# EAGLE design AD_inputs (EAGLE 7.7.0)
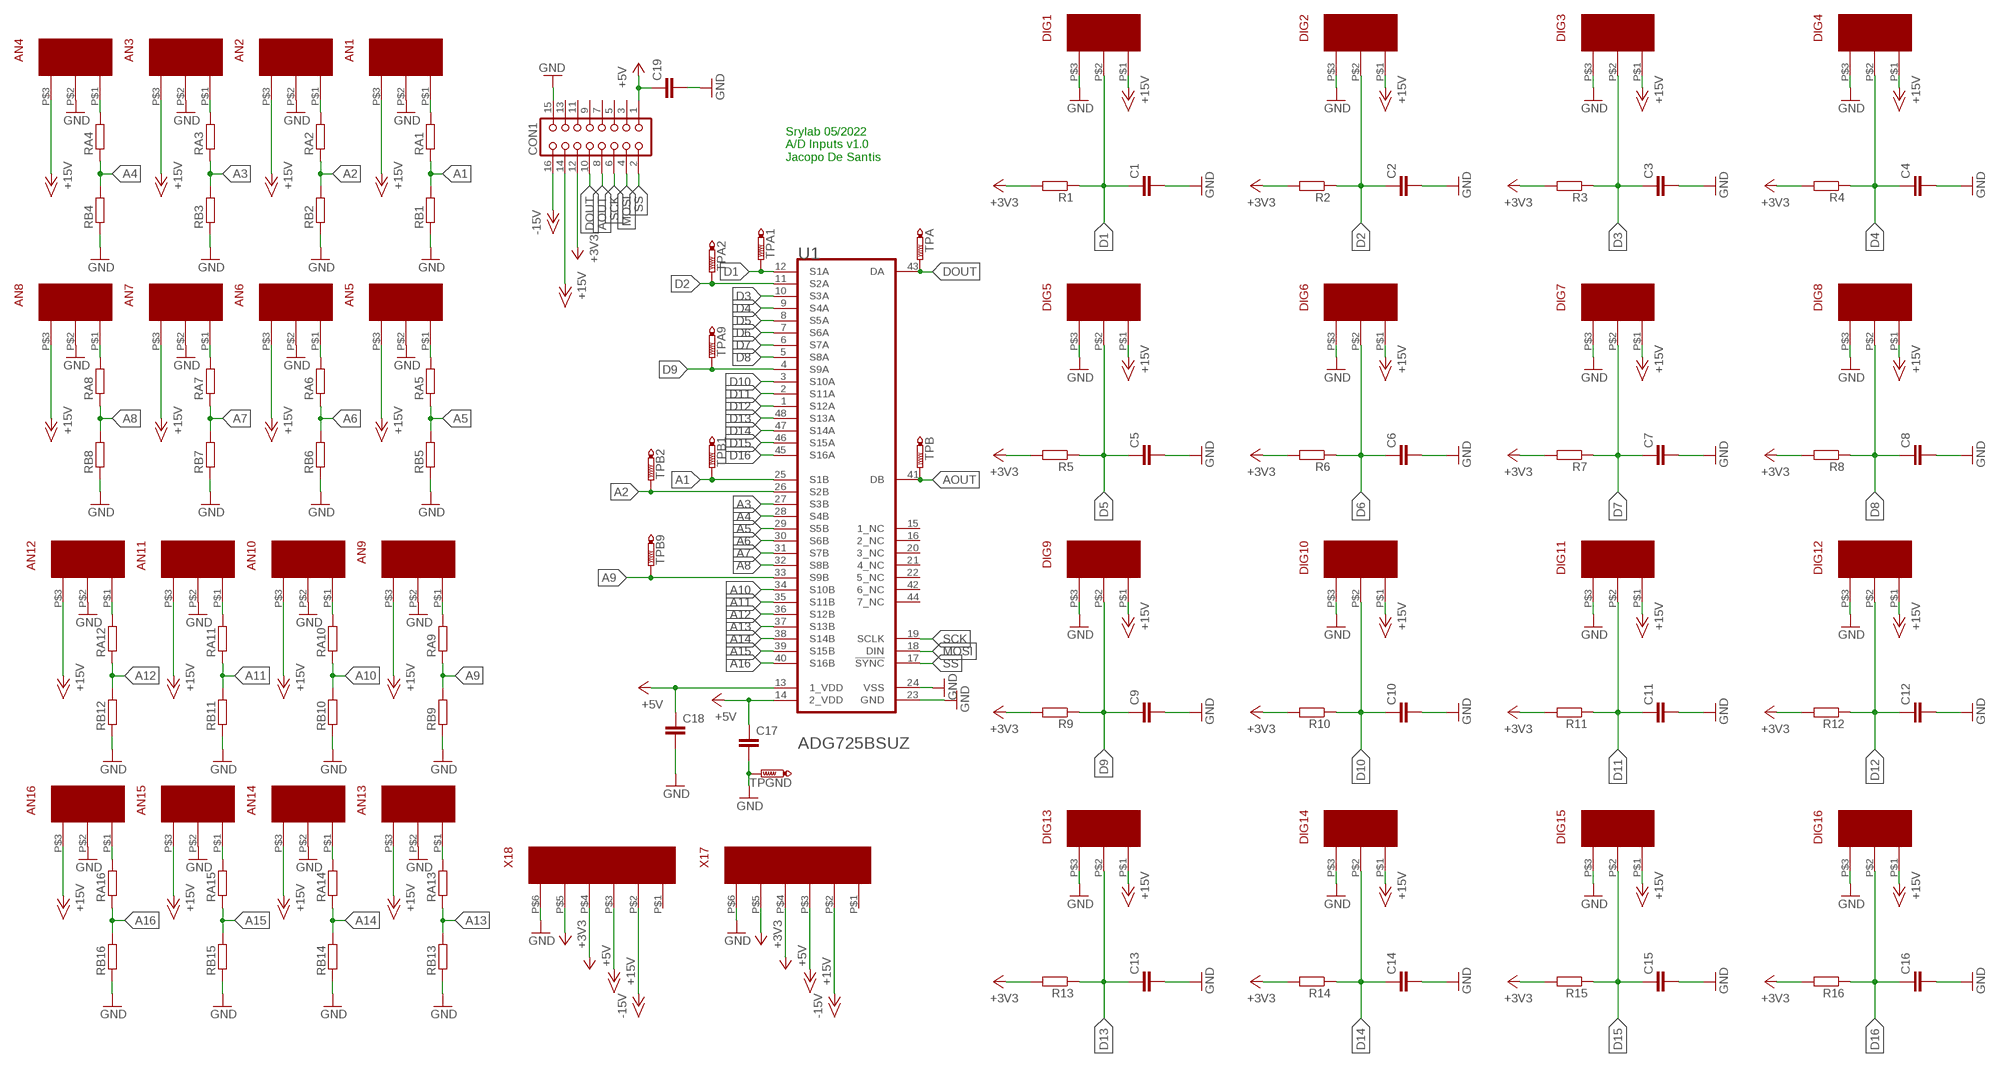
[diagram p0: schematic, sheet 1]

## Parts
AN1  3PIN_CON  [3PIN_CON]
AN2  3PIN_CON  [3PIN_CON]
AN3  3PIN_CON  [3PIN_CON]
AN4  3PIN_CON  [3PIN_CON]
AN5  3PIN_CON  [3PIN_CON]
AN6  3PIN_CON  [3PIN_CON]
AN7  3PIN_CON  [3PIN_CON]
AN8  3PIN_CON  [3PIN_CON]
AN9  3PIN_CON  [3PIN_CON]
AN10  3PIN_CON  [3PIN_CON]
AN11  3PIN_CON  [3PIN_CON]
AN12  3PIN_CON  [3PIN_CON]
AN13  3PIN_CON  [3PIN_CON]
AN14  3PIN_CON  [3PIN_CON]
AN15  3PIN_CON  [3PIN_CON]
AN16  3PIN_CON  [3PIN_CON]
C1  C-EU_SMD0805  [C0805]
C2  C-EU_SMD0805  [C0805]
C3  C-EU_SMD0805  [C0805]
C4  C-EU_SMD0805  [C0805]
C5  C-EU_SMD0805  [C0805]
C6  C-EU_SMD0805  [C0805]
C7  C-EU_SMD0805  [C0805]
C8  C-EU_SMD0805  [C0805]
C9  C-EU_SMD0805  [C0805]
C10  C-EU_SMD0805  [C0805]
C11  C-EU_SMD0805  [C0805]
C12  C-EU_SMD0805  [C0805]
C13  C-EU_SMD0805  [C0805]
C14  C-EU_SMD0805  [C0805]
C15  C-EU_SMD0805  [C0805]
C16  C-EU_SMD0805  [C0805]
C17  C-EU_SMDC1206H/D  [C1206H/D]
C18  C-EU_SMDC1206H/D  [C1206H/D]
C19  C-EU_SMDC1206H/D  [C1206H/D]
CON1  CON16L  [CON16L]
DIG1  3PIN_CON  [3PIN_CON]
DIG2  3PIN_CON  [3PIN_CON]
DIG3  3PIN_CON  [3PIN_CON]
DIG4  3PIN_CON  [3PIN_CON]
DIG5  3PIN_CON  [3PIN_CON]
DIG6  3PIN_CON  [3PIN_CON]
DIG7  3PIN_CON  [3PIN_CON]
DIG8  3PIN_CON  [3PIN_CON]
DIG9  3PIN_CON  [3PIN_CON]
DIG10  3PIN_CON  [3PIN_CON]
DIG11  3PIN_CON  [3PIN_CON]
DIG12  3PIN_CON  [3PIN_CON]
DIG13  3PIN_CON  [3PIN_CON]
DIG14  3PIN_CON  [3PIN_CON]
DIG15  3PIN_CON  [3PIN_CON]
DIG16  3PIN_CON  [3PIN_CON]
R1  R-EU_SMD0805H  [R0805H]
R2  R-EU_SMD0805H  [R0805H]
R3  R-EU_SMD0805H  [R0805H]
R4  R-EU_SMD0805H  [R0805H]
R5  R-EU_SMD0805H  [R0805H]
R6  R-EU_SMD0805H  [R0805H]
R7  R-EU_SMD0805H  [R0805H]
R8  R-EU_SMD0805H  [R0805H]
R9  R-EU_SMD0805H  [R0805H]
R10  R-EU_SMD0805H  [R0805H]
R11  R-EU_SMD0805H  [R0805H]
R12  R-EU_SMD0805H  [R0805H]
R13  R-EU_SMD0805H  [R0805H]
R14  R-EU_SMD0805H  [R0805H]
R15  R-EU_SMD0805H  [R0805H]
R16  R-EU_SMD0805H  [R0805H]
RA1  R-EU_SMD0805H  [R0805H]
RA2  R-EU_SMD0805H  [R0805H]
RA3  R-EU_SMD0805H  [R0805H]
RA4  R-EU_SMD0805H  [R0805H]
RA5  R-EU_SMD0805H  [R0805H]
RA6  R-EU_SMD0805H  [R0805H]
RA7  R-EU_SMD0805H  [R0805H]
RA8  R-EU_SMD0805H  [R0805H]
RA9  R-EU_SMD0805H  [R0805H]
RA10  R-EU_SMD0805H  [R0805H]
RA11  R-EU_SMD0805H  [R0805H]
RA12  R-EU_SMD0805H  [R0805H]
RA13  R-EU_SMD0805H  [R0805H]
RA14  R-EU_SMD0805H  [R0805H]
RA15  R-EU_SMD0805H  [R0805H]
RA16  R-EU_SMD0805H  [R0805H]
RB1  R-EU_SMD0805H  [R0805H]
RB2  R-EU_SMD0805H  [R0805H]
RB3  R-EU_SMD0805H  [R0805H]
RB4  R-EU_SMD0805H  [R0805H]
RB5  R-EU_SMD0805H  [R0805H]
RB6  R-EU_SMD0805H  [R0805H]
RB7  R-EU_SMD0805H  [R0805H]
RB8  R-EU_SMD0805H  [R0805H]
RB9  R-EU_SMD0805H  [R0805H]
RB10  R-EU_SMD0805H  [R0805H]
RB11  R-EU_SMD0805H  [R0805H]
RB12  R-EU_SMD0805H  [R0805H]
RB13  R-EU_SMD0805H  [R0805H]
RB14  R-EU_SMD0805H  [R0805H]
RB15  R-EU_SMD0805H  [R0805H]
RB16  R-EU_SMD0805H  [R0805H]
TPA  PTR1TP20R  [TP20R]
TPA1  PTR1TP20R  [TP20R]
TPA2  PTR1TP20R  [TP20R]
TPA9  PTR1TP20R  [TP20R]
TPB  PTR1TP20R  [TP20R]
TPB1  PTR1TP20R  [TP20R]
TPB2  PTR1TP20R  [TP20R]
TPB9  PTR1TP20R  [TP20R]
TPGND  PTR1TP20R  [TP20R]
U1  ANALOG_DEVICES_ADG725BSUZANALOG_DEVICES_ADG725BSUZ_0_2  [ANALOG_DEVICES_ADG725BSUZ_2]
X17  6PIN_CON  [6PIN_CON]
X18  6PIN_CON  [6PIN_CON]

## Nets
+3V3: CON1.12 R1.2 R2.2 R3.2 R4.2 R5.2 R6.2 R7.2 R8.2 R9.2 R10.2 R11.2 R12.2 R13.2 R14.2 R15.2 R16.2 X17.P$5 X18.P$5
+5V: C17.1 C18.1 C19.1 CON1.1 U1.13(1_VDD) U1.14(2_VDD) X17.P$4 X18.P$4
+15V: AN1.P$3 AN2.P$3 AN3.P$3 AN4.P$3 AN5.P$3 AN6.P$3 AN7.P$3 AN8.P$3 AN9.P$3 AN10.P$3 AN11.P$3 AN12.P$3 AN13.P$3 AN14.P$3 AN15.P$3 AN16.P$3 CON1.14 DIG1.P$1 DIG2.P$1 DIG3.P$1 DIG4.P$1 DIG5.P$1 DIG6.P$1 DIG7.P$1 DIG8.P$1 DIG9.P$1 DIG10.P$1 DIG11.P$1 DIG12.P$1 DIG13.P$1 DIG14.P$1 DIG15.P$1 DIG16.P$1 X17.P$3 X18.P$3
-15V: CON1.16 X17.P$2 X18.P$2
A1: RA1.1 RB1.2 TPB1.TP U1.25(S1B)
A2: RA2.1 RB2.2 TPB2.TP U1.26(S2B)
A3: RA3.1 RB3.2 U1.27(S3B)
A4: RA4.1 RB4.2 U1.28(S4B)
A5: RA5.1 RB5.2 U1.29(S5B)
A6: RA6.1 RB6.2 U1.30(S6B)
A7: RA7.1 RB7.2 U1.31(S7B)
A8: RA8.1 RB8.2 U1.32(S8B)
A9: RA9.1 RB9.2 TPB9.TP U1.33(S9B)
A10: RA10.1 RB10.2 U1.34(S10B)
A11: RA11.1 RB11.2 U1.35(S11B)
A12: RA12.1 RB12.2 U1.36(S12B)
A13: RA13.1 RB13.2 U1.37(S13B)
A14: RA14.1 RB14.2 U1.38(S14B)
A15: RA15.1 RB15.2 U1.39(S15B)
A16: RA16.1 RB16.2 U1.40(S16B)
AOUT: CON1.8 TPB.TP U1.41(DB)
D1: C1.1 DIG1.P$2 R1.1 TPA1.TP U1.12(S1A)
D2: C2.1 DIG2.P$2 R2.1 TPA2.TP U1.11(S2A)
D3: C3.1 DIG3.P$2 R3.1 U1.10(S3A)
D4: C4.1 DIG4.P$2 R4.1 U1.9(S4A)
D5: C5.1 DIG5.P$2 R5.1 U1.8(S5A)
D6: C6.1 DIG6.P$2 R6.1 U1.7(S6A)
D7: C7.1 DIG7.P$2 R7.1 U1.6(S7A)
D8: C8.1 DIG8.P$2 R8.1 U1.5(S8A)
D9: C9.1 DIG9.P$2 R9.1 TPA9.TP U1.4(S9A)
D10: C10.1 DIG10.P$2 R10.1 U1.3(S10A)
D11: C11.1 DIG11.P$2 R11.1 U1.2(S11A)
D12: C12.1 DIG12.P$2 R12.1 U1.1(S12A)
D13: C13.1 DIG13.P$2 R13.1 U1.48(S13A)
D14: C14.1 DIG14.P$2 R14.1 U1.47(S14A)
D15: C15.1 DIG15.P$2 R15.1 U1.46(S15A)
D16: C16.1 DIG16.P$2 R16.1 U1.45(S16A)
DOUT: CON1.10 TPA.TP U1.43(DA)
GND: AN1.P$2 AN2.P$2 AN3.P$2 AN4.P$2 AN5.P$2 AN6.P$2 AN7.P$2 AN8.P$2 AN9.P$2 AN10.P$2 AN11.P$2 AN12.P$2 AN13.P$2 AN14.P$2 AN15.P$2 AN16.P$2 C1.2 C2.2 C3.2 C4.2 C5.2 C6.2 C7.2 C8.2 C9.2 C10.2 C11.2 C12.2 C13.2 C14.2 C15.2 C16.2 C17.2 C18.2 C19.2 CON1.15 DIG1.P$3 DIG2.P$3 DIG3.P$3 DIG4.P$3 DIG5.P$3 DIG6.P$3 DIG7.P$3 DIG8.P$3 DIG9.P$3 DIG10.P$3 DIG11.P$3 DIG12.P$3 DIG13.P$3 DIG14.P$3 DIG15.P$3 DIG16.P$3 RB1.1 RB2.1 RB3.1 RB4.1 RB5.1 RB6.1 RB7.1 RB8.1 RB9.1 RB10.1 RB11.1 RB12.1 RB13.1 RB14.1 RB15.1 RB16.1 TPGND.TP U1.23(GND) U1.24(VSS) X17.P$6 X18.P$6
MOSI: CON1.4 U1.18(DIN)
N$1: AN2.P$1 RA2.2
N$2: AN1.P$1 RA1.2
N$3: AN3.P$1 RA3.2
N$4: AN4.P$1 RA4.2
N$5: AN5.P$1 RA5.2
N$6: AN6.P$1 RA6.2
N$7: AN7.P$1 RA7.2
N$8: AN8.P$1 RA8.2
N$9: AN9.P$1 RA9.2
N$10: AN10.P$1 RA10.2
N$11: AN11.P$1 RA11.2
N$12: AN12.P$1 RA12.2
N$13: AN13.P$1 RA13.2
N$14: AN14.P$1 RA14.2
N$15: AN15.P$1 RA15.2
N$16: AN16.P$1 RA16.2
SCK: CON1.6 U1.19(SCLK)
SS: CON1.2 U1.17(!SYNC!)
Unconnected: CON1.3 CON1.5 CON1.7 CON1.9 CON1.11 CON1.13 U1.15(1_NC) U1.16(2_NC) U1.20(3_NC) U1.21(4_NC) U1.22(5_NC) U1.42(6_NC) U1.44(7_NC) X17.P$1 X18.P$1

## Notes on the sheet
- Srylab 05/2022
  A/D Inputs v1.0
  Jacopo De Santis

## Library data of the parts
AN1-AN16 DIG1-DIG16 = CoilCircuitLibrary_E7:3PIN_CON
C1-C19 = 1AKarstenLib:C-EU_SMD: Capacitor, SMD only European Symbol Copied/Created July 2012 by K.F. Changed September 2016 by K.F.
CON1 = con-harting:CON16L: CONNECTOR; OC_FARNELL: unknown; OC_NEWARK: unknown
R1-R16 RA1-RA16 RB1-RB16 = 1AKarstenLib:R-EU_SMD: Resistor, SMD only European Symbol Copied/Created July 2012 by K.F.
TPA TPA1 TPA2 TPA9 TPB TPB1 TPB2 TPB9 TPGND = testpad:PTR1: TEST PIN
U1 = Analog Devices - ADG725BSUZ:ANALOG_DEVICES_ADG725BSUZ: ADI-ADG725-SU-48; BANDWIDTH_HZ: 34M; CIIVA_IDS: 987218; CODE__JEDEC: MS-026ABC; COMPONENT_LINK_1_DESCRIPTION: Manufacturer URL; COMPONENT_LINK_1_URL: http://www.analog.com/en/index.html; COMPONENT_LINK_3_DESCRIPTION: Package Specification; COMPONENT_LINK_3_URL: http://www.analog.com/static/imported-files/packages/470644706845302410119987SU48_7x7.pdf; DATASHEET: http://www.analog.com/static/imported-files/data_sheets/ADG725_731.pdf; DATASHEET_VERSION: Rev. A; FOOTPRINT_VARIANT_NAME_0: Level C; FOOTPRINT_VARIANT_NAME_1: Level B; FOOTPRINT_VARIANT_NAME_2: Level A; IMPORTED: yes; IMPORTED_FROM: vault; IMPORT_TS: 1521844804; MAX_ANALOG_SIGNAL_RANGE: Vss to Vdd; MF: Analog Devices; MOUNTING_TECHNOLOGY: Surface Mount; MPN: ADG725BSUZ; PACKAGE: SU-48; PACKAGE_DESCRIPTION: 48-Pin Thin Plastic Quad Flat Package, Body 7 x 7 mm, Pitch 0.5 mm; PACKING: Tray; PIN_0_0_18_INSIDE_EDGE: clock; PREFIX: U; RELEASE_DATE: 1391107388; RON_OHMS: 4; SUPPLY_V_GUAR_PERFORMANCE: Dual_(+/-2.5V), Single_(+3V), Single_(+5V); T_TRANSITION_S: 42n; VAULT_GUID: 7876A2FD-0DAB-484C-9F25-628C39C8E5EF; VAULT_REVISION: 63445D66-2062-4CF5-BB4E-A8A3DC790AA5
X17 X18 = CoilCircuitLibrary_E7:6PIN_CON

## Board
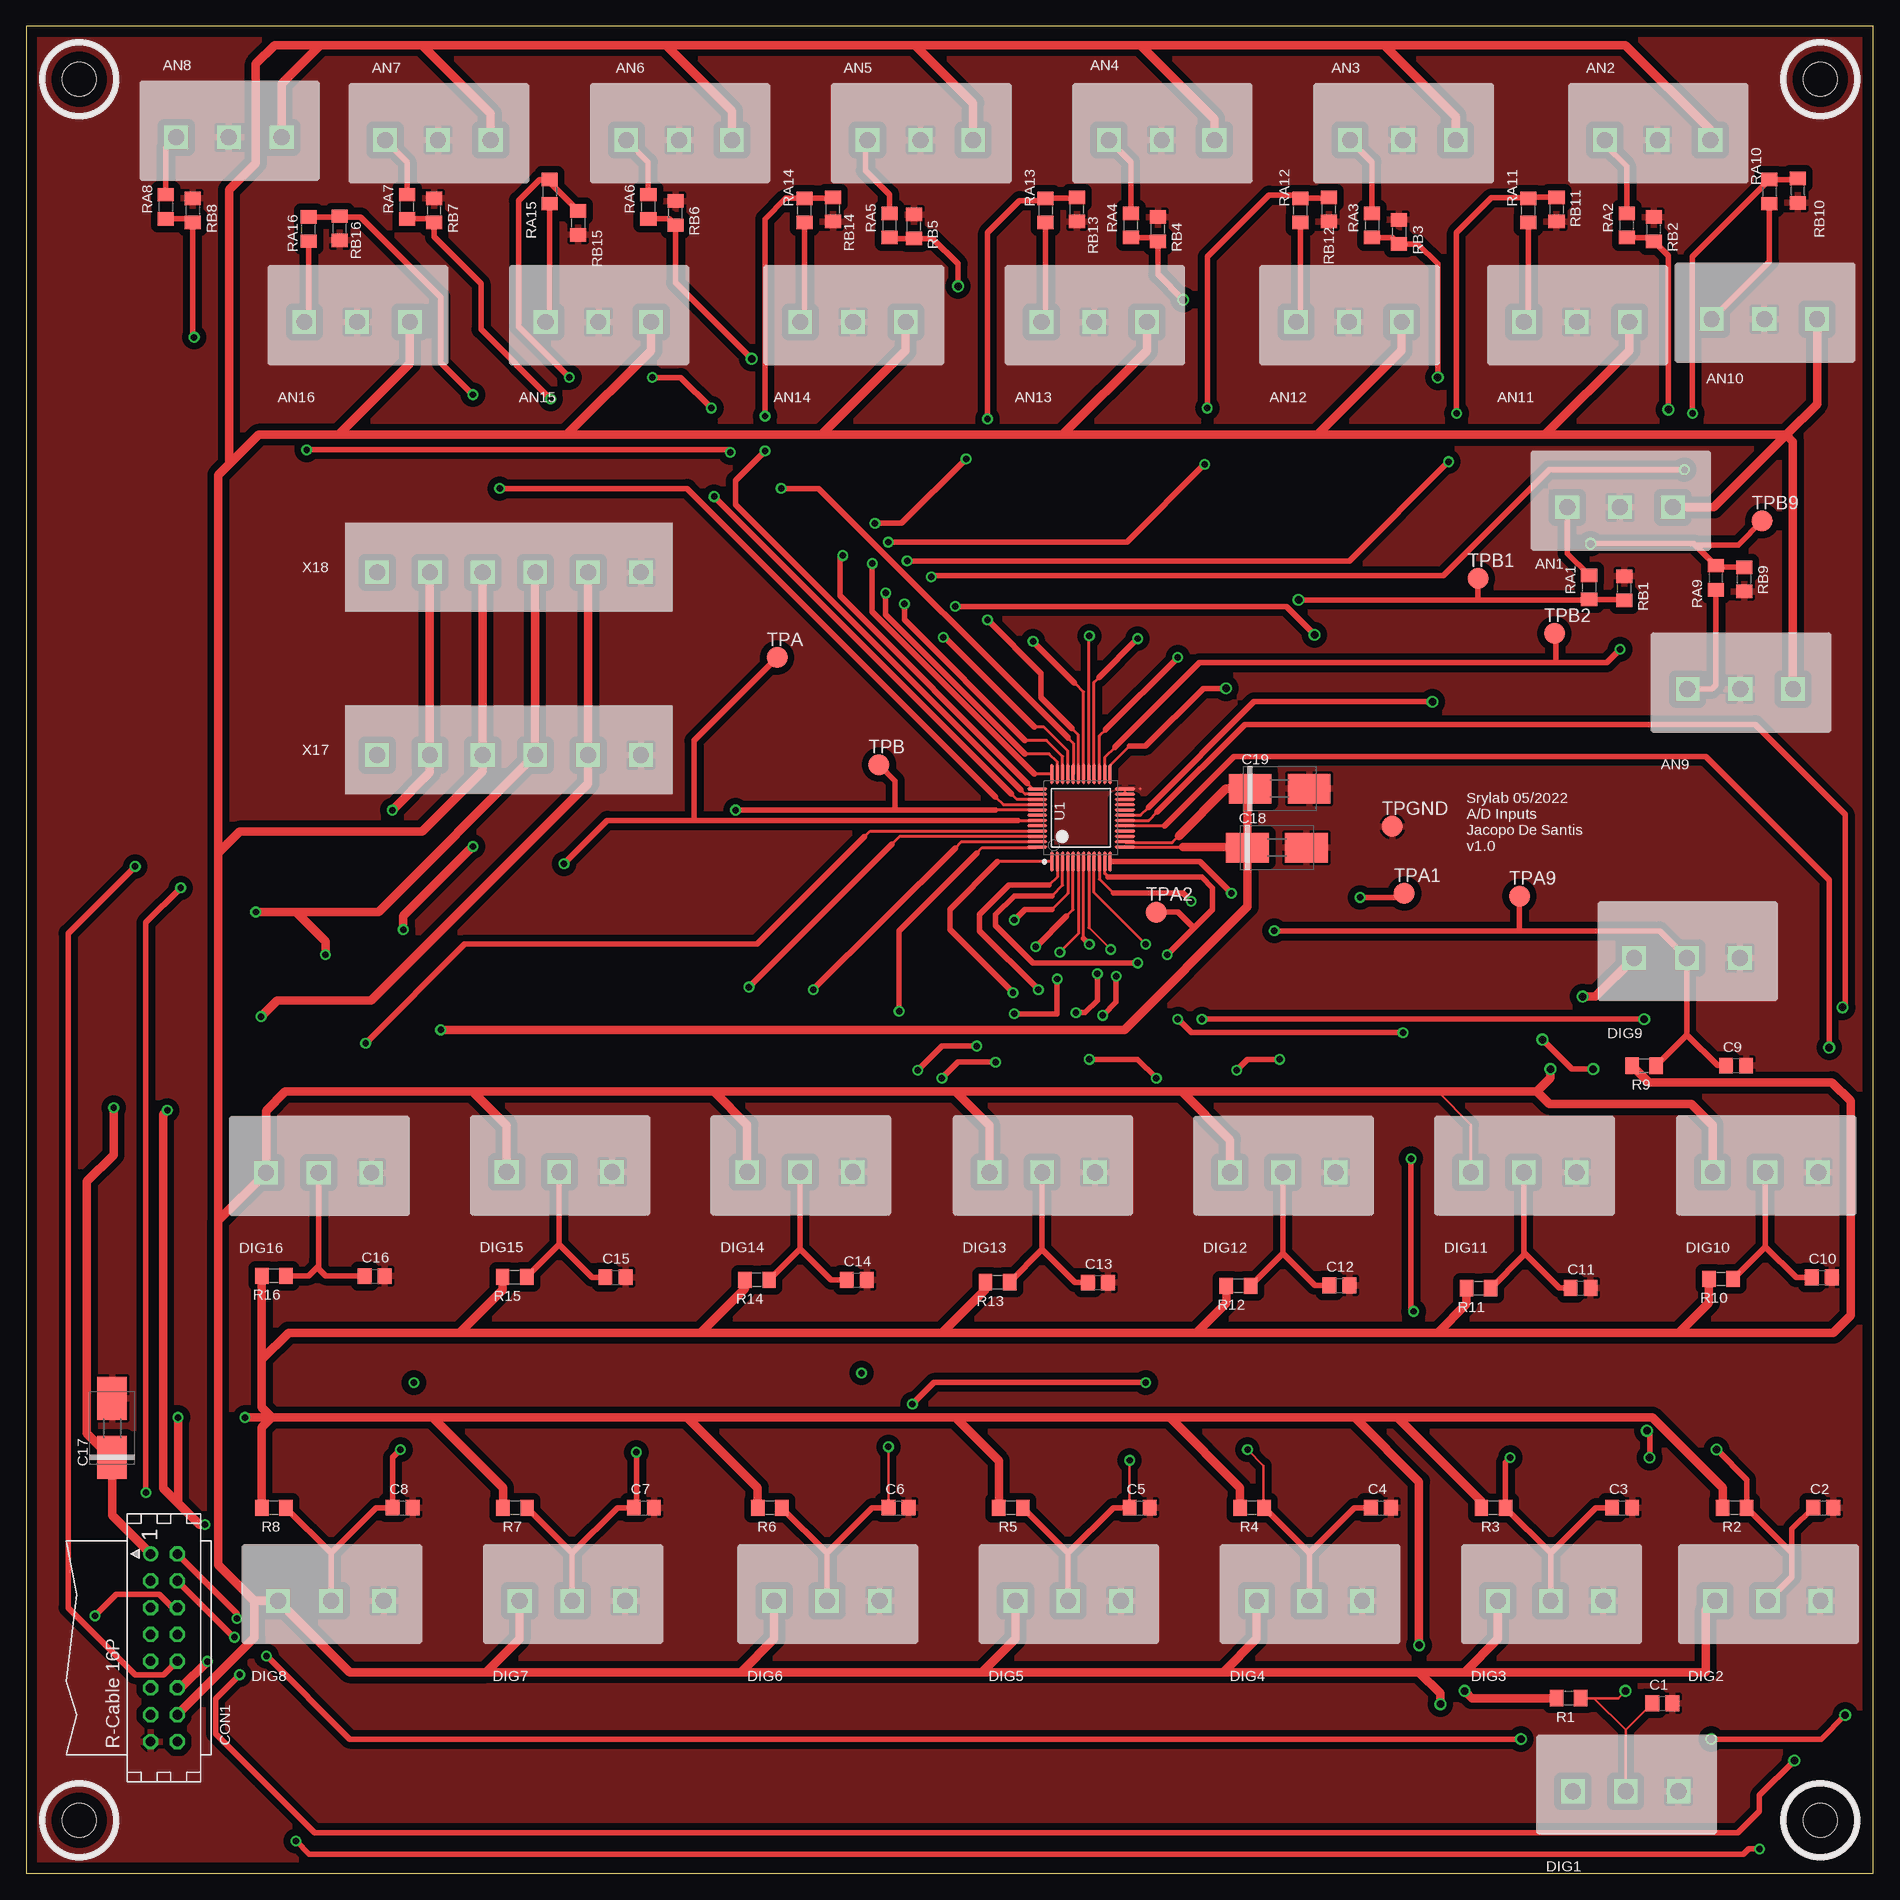
[diagram p1: board, top side]
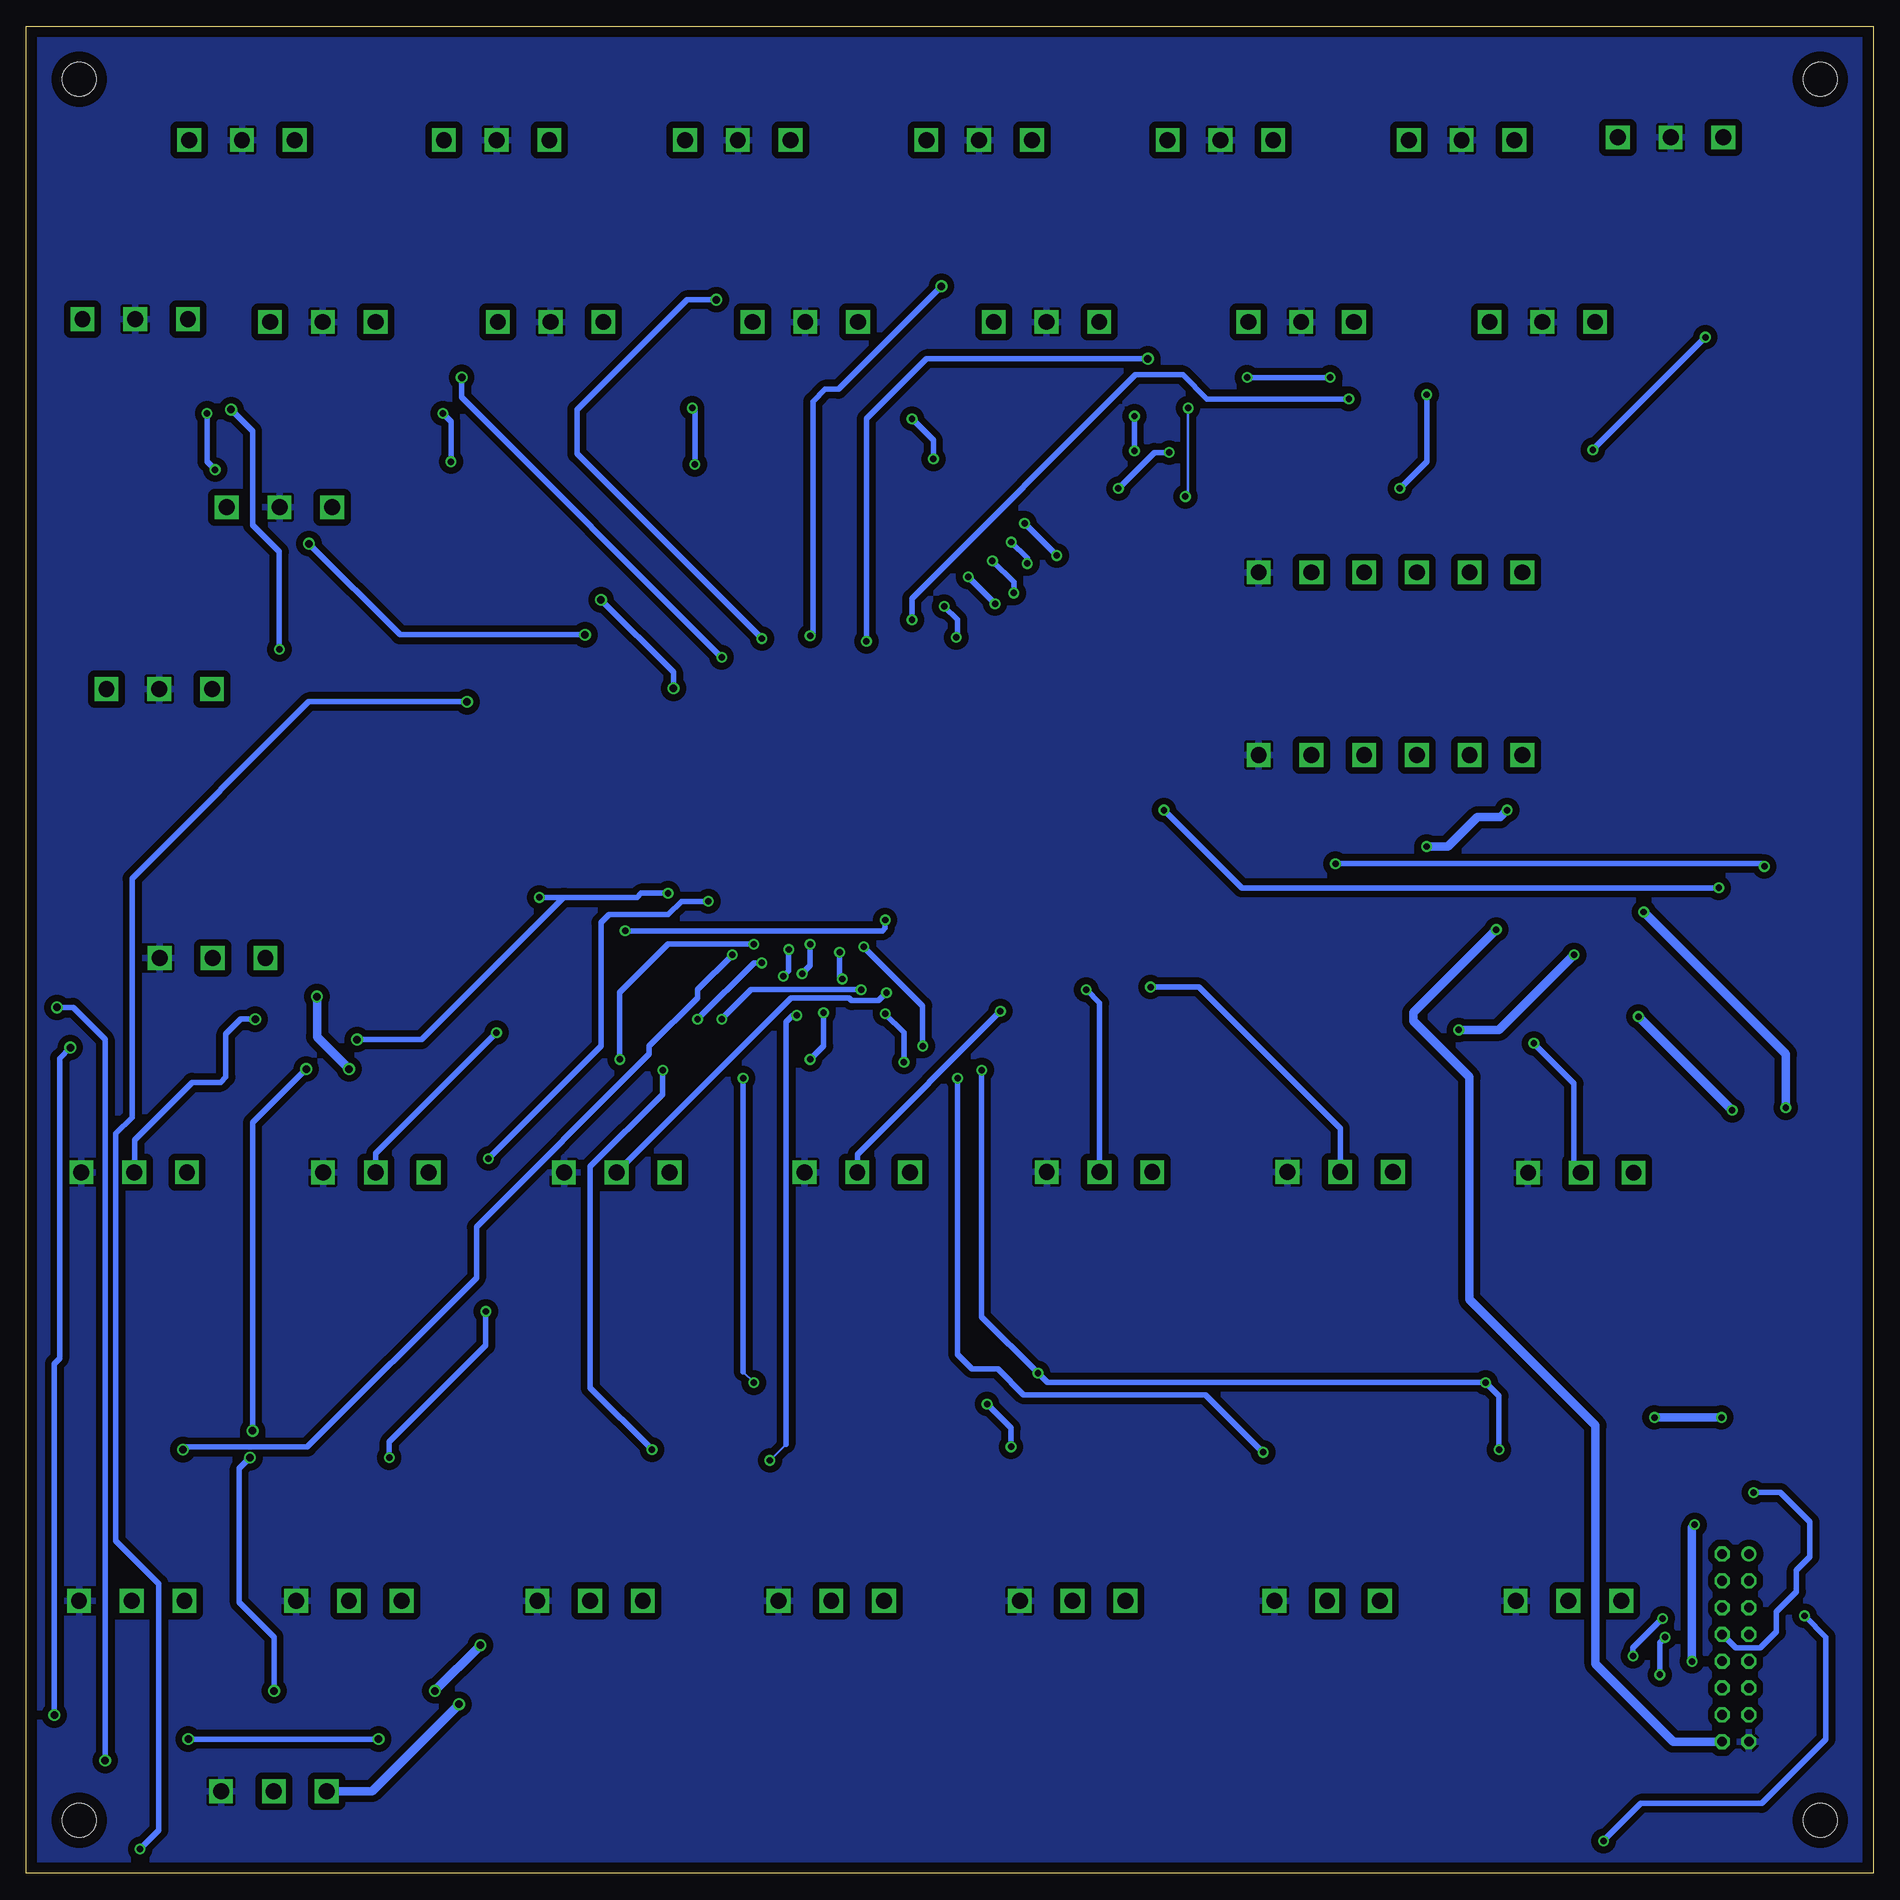
[diagram p2: board, bottom side, seen from below]

Size 175 x 175 mm. Coordinates in mm from the lower left corner, seen from the top.
Outline: 0,0 175,0 175,175 0,175 0,0
Copper layers (1*16): Top 0.035mm / dielectric 1.5mm / Bottom 0.035mm
Design rules "default *": minimum track width 10mil, minimum drill 24mil, track to track 6mil, track to pad 6mil, pad to pad 6mil, via to via 6mil, smd to smd 6mil, copper to edge 40mil, drill to drill 8mil, minimum pad ring 10mil, minimum via ring 8mil, stop-mask expansion 4mil, vias tented up to drill 0mil, thermal gap 10mil
Holes 3.2 mm at 5,5 170,5 170,170 5,170

### Footprints (pad centres in the part's own frame; a part is rotated, then mirrored left to right if it is on the bottom)
3PIN_CON = drill 1.5 square: P$1 0,0; P$2 5,0; P$3 10,0
C0805 = smd 1.3 x 1.5: 1 -0.95,0; 2 0.95,0
C1206H/D = smd 4.064 x 2.794: 1 -2.794,0; 2 2.794,0
CON16L = drill 0.914: 1 8.89,1.27 | drill 0.914 octagon: 2 8.89,-1.27; 3 6.35,1.27; 4 6.35,-1.27; 5 3.81,1.27; 6 3.81,-1.27; 7 1.27,1.27; 8 1.27,-1.27; 9 -1.27,1.27; 10 -1.27,-1.27; 11 -3.81,1.27; 12 -3.81,-1.27; 13 -6.35,1.27; 14 -6.35,-1.27; 15 -8.89,1.27; 16 -8.89,-1.27
R0805H = smd 1.27 x 1.524: 1 -1.143,0; 2 1.143,0
TP20R = smd 2 x 2: TP 0,0
ANALOG_DEVICES_ADG725BSUZ_2 = smd 1.95 x 0.3: 1 -4.15,2.75; 2 -4.15,2.25; 3 -4.15,1.75; 4 -4.15,1.25; 5 -4.15,0.75; 6 -4.15,0.25; 7 -4.15,-0.25; 8 -4.15,-0.75; 9 -4.15,-1.25; 10 -4.15,-1.75; 11 -4.15,-2.25; 12 -4.15,-2.75; 25 4.15,-2.75; 26 4.15,-2.25; 27 4.15,-1.75; 28 4.15,-1.25; 29 4.15,-0.75; 30 4.15,-0.25; 31 4.15,0.25; 32 4.15,0.75; 33 4.15,1.25; 34 4.15,1.75; 35 4.15,2.25; 36 4.15,2.75 | smd 0.3 x 1.95: 13 -2.75,-4.15; 14 -2.25,-4.15; 15 -1.75,-4.15; 16 -1.25,-4.15; 17 -0.75,-4.15; 18 -0.25,-4.15; 19 0.25,-4.15; 20 0.75,-4.15; 21 1.25,-4.15; 22 1.75,-4.15; 23 2.25,-4.15; 24 2.75,-4.15; 37 2.75,4.15; 38 2.25,4.15; 39 1.75,4.15; 40 1.25,4.15; 41 0.75,4.15; 42 0.25,4.15; 43 -0.25,4.15; 44 -0.75,4.15; 45 -1.25,4.15; 46 -1.75,4.15; 47 -2.25,4.15; 48 -2.75,4.15
6PIN_CON = drill 1.5 square: P$1 0,0; P$2 5,0; P$3 10,0; P$4 15,0; P$5 20,0; P$6 25,0

### Placement (x,y rotation side)
AN1  146.01,129.43 0 top
AN2  149.57,164.23 0 top
AN3  125.44,164.23 0 top
AN4  102.58,164.23 0 top
AN5  79.72,164.23 0 top
AN6  56.86,164.23 0 top
AN7  34,164.23 0 top
AN8  14.19,164.48 0 top
AN9  157.4,112.19 0 top
AN10  159.69,147.24 0 top
AN11  141.91,146.99 0 top
AN12  120.32,146.99 0 top
AN13  96.19,146.99 0 top
AN14  73.33,146.99 0 top
AN15  49.2,146.99 0 top
AN16  26.34,146.99 0 top
C1  155.03,16.09 0 top
C2  170.27,34.63 0 top
C3  151.22,34.63 0 top
C4  128.36,34.63 0 top
C5  105.5,34.63 0 top
C6  82.64,34.63 0 top
C7  58.51,34.63 0 top
C8  35.65,34.63 0 top
C9  162.02,76.52 0 top
C10  170.14,56.45 0 top
C11  147.28,55.44 0 top
C12  124.42,55.7 0 top
C13  101.55,55.96 0 top
C14  78.69,56.21 0 top
C15  55.83,56.47 0 top
C16  33,56.57 0 top
C17  8.12,42.18 90 top
C18  118.51,97.17 0 top
C19  118.76,102.76 0 top
CON1  13.04,21.35 90 top
DIG1  146.55,7.77 0 top
DIG2  160.01,25.8 0 top
DIG3  139.44,25.8 0 top
DIG4  116.58,25.8 0 top
DIG5  93.72,25.8 0 top
DIG6  70.86,25.8 0 top
DIG7  46.73,25.8 0 top
DIG8  23.87,25.8 0 top
DIG9  152.35,86.72 0 top
DIG10  159.79,66.41 0 top
DIG11  136.89,66.4 0 top
DIG12  114.06,66.4 0 top
DIG13  91.26,66.41 0 top
DIG14  68.31,66.43 0 top
DIG15  45.5,66.44 0 top
DIG16  22.7,66.37 0 top
R1  146.13,16.59 180 top
R2  161.88,34.62 180 top
R3  139.02,34.62 180 top
R4  116.16,34.62 180 top
R5  93.3,34.62 180 top
R6  70.44,34.62 180 top
R7  46.31,34.62 180 top
R8  23.45,34.62 180 top
R9  153.29,76.51 180 top
R10  160.59,56.31 180 top
R11  137.61,55.43 180 top
R12  114.85,55.65 180 top
R13  92.03,56 180 top
R14  69.23,56.22 180 top
R15  46.27,56.49 180 top
R16  23.45,56.61 180 top
RA1  148.09,121.84 90 top
RA2  151.64,156.13 90 top
RA3  127.51,156.13 90 top
RA4  104.65,156.13 90 top
RA5  81.79,156.13 90 top
RA6  58.93,157.91 90 top
RA7  36.07,157.91 90 top
RA8  13.21,157.91 90 top
RA9  160.09,122.76 270 top
RA10  165.17,159.34 270 top
RA11  142.31,157.56 270 top
RA12  120.72,157.56 270 top
RA13  96.59,157.56 270 top
RA14  73.73,157.56 270 top
RA15  49.6,159.34 270 top
RA16  26.74,155.78 270 top
RB1  151.42,121.74 270 top
RB2  154.21,155.78 270 top
RB3  130.08,155.53 270 top
RB4  107.22,155.78 270 top
RB5  84.11,156.03 270 top
RB6  61.5,157.3 270 top
RB7  38.64,157.56 270 top
RB8  15.78,157.56 270 top
RB9  162.78,122.6 90 top
RB10  167.86,159.43 90 top
RB11  145,157.65 90 top
RB12  123.41,157.65 90 top
RB13  99.54,157.65 90 top
RB14  76.42,157.65 90 top
RB15  52.29,156.38 90 top
RB16  29.69,155.87 90 top
TPA  71.14,115.19 0 top
TPA1  130.57,92.84 0 top
TPA2  107.08,91.06 0 top
TPA9  141.5,92.58 0 top
TPB  80.79,105.03 0 top
TPB1  137.56,122.68 0 top
TPB2  144.8,117.47 0 top
TPB9  164.48,128.14 0 top
TPGND  129.43,99.19 0 top
U1  99.94,100 90 top
X17  33.23,105.95 0 top
X18  33.23,123.26 0 top

### Tracks (layer width: path | path; a pad name or v marks a point on that pad's centre or on a via)
+3V3  (via drill 0.61, 0.71)
  Top 0.254: R6.2 69.3,35.24 | R5.2 92.16,35.24 | R4.2 115.02,35.24 | R3.2 137.88,35.24 | CON1.12 14.64,17.54
  Top 0.813: 14.37,35.05 v14.37,43.18 | v20.72,43.18 23.26,43.18 | 23.26,43.18 38.5,43.18 | 38.5,43.18 62.63,43.18 | 62.63,43.18 88.03,43.18 | 88.03,43.18 108.35,43.18 | 108.35,43.18 125.88,43.18 | 125.88,43.18 129.94,43.18 | 129.94,43.18 154.07,43.18 160.74,36.51 R2.2 | R16.2 22.31,48.66 | R15.2 45.13,55.29 41.04,51.2 | 41.04,51.2 24.85,51.2 22.31,48.66 | 156.61,51.2 171.23,51.2 172.87,52.83 172.87,73.15 171.09,74.93 153.73,74.93 R9.2 | 156.61,51.2 133.75,51.2 | 133.75,51.2 110.89,51.2 | 110.89,51.2 86.76,51.2 | 86.76,51.2 63.9,51.2 | 63.9,51.2 41.04,51.2 | R14.2 68.09,55.39 63.9,51.2 | R13.2 90.89,55.33 86.76,51.2 | R12.2 113.71,54.02 110.89,51.2 | R11.2 136.47,53.92 133.75,51.2 | R10.2 159.45,54.04 156.61,51.2 | 22.31,48.66 22.31,44.13 23.26,43.18 | R8.2 22.31,42.23 23.26,43.18 | R7.2 45.17,36.51 38.5,43.18 | R6.2 69.3,36.51 62.63,43.18 | R5.2 92.16,39.05 88.03,43.18 | R4.2 115.02,36.51 108.35,43.18 | 137.88,35.24 129.94,43.18 | X18.P$5 X17.P$5 53.23,103.27 32.66,82.7 23.77,82.7 v22.24,81.17 | 14.37,35.05 12.97,36.45 12.97,71.9 v13.35,72.28 | 14.64,17.54 v17.16,20.07 | v16.91,33.02 16.4,33.02 14.37,35.05 | R1.2 136.98,16.59 v136.29,17.27 | v131.97,21.59 131.97,37.08 125.88,43.18
  Bottom 0.813: v14.37,43.18 v20.72,43.18 | v22.24,81.17 v13.35,72.28 | v17.16,20.07 17.16,32.77 v16.91,33.02 | v136.29,17.27 v131.97,21.59
+5V  (via drill 0.61)
  Top 0.254: 104.15,97.68 U1.14 | 115.72,102.51 C19.1 | 115.64,97.25 C18.1
  Top 0.305: 104.15,97.68 108.6,97.68 108.6,97.69 109.21,98.3 | U1.13 109.59,97.25 109.59,97.26
  Top 0.508: 109.22,98.3 109.21,98.3 | 8,39.39 C17.1
  Top 0.813: v21.74,91.08 25.55,91.08 | 25.55,91.08 33.36,91.08 X17.P$4 X18.P$4 | C18.1 115.72,91.59 104.03,79.9 v39.26,79.9 | v28.34,87.01 28.34,88.28 25.55,91.08 | C18.1 115.72,102.51 | C19.1 113.68,102.76 109.22,98.3 | v8.27,72.54 8.27,68.07 5.73,65.53 5.73,41.66 8,39.39 | CON1.1 8.12,33.89 C17.1 | 109.59,97.26 115.72,97.26 C18.1
  Bottom 0.813: v8.27,72.54 8.27,77.62 v21.74,91.08 | v39.26,79.9 35.45,79.9 v28.34,87.01
+15V  (via drill 0.71)
  Top 0.254: DIG11.P$1 136.89,70.92 133.75,74.06
  Top 0.813: 42.31,74.06 24.53,74.06 22.7,72.23 DIG16.P$1 18.18,61.85 | 42.31,74.06 65.17,74.06 | 65.17,74.06 88.03,74.06 | 88.03,74.06 109.49,74.06 | 109.49,74.06 133.75,74.06 143.15,74.06 | DIG10.P$1 159.79,70.88 159.77,70.88 157.75,72.9 144.31,72.9 143.15,74.06 | DIG13.P$1 91.26,70.83 88.03,74.06 | DIG14.P$1 68.31,70.92 65.17,74.06 | DIG15.P$1 45.5,70.87 42.31,74.06 | 21.59,25.8 DIG8.P$1 30.62,19.05 43.58,19.05 | 21.59,25.8 18.18,29.21 18.18,61.85 | DIG7.P$1 46.73,22.2 43.58,19.05 | DIG6.P$1 70.86,22.2 67.71,19.05 | 67.71,19.05 43.58,19.05 | DIG5.P$1 93.72,22.2 90.57,19.05 | 90.57,19.05 67.71,19.05 | DIG4.P$1 116.58,22.2 113.43,19.05 | 113.43,19.05 90.57,19.05 | DIG3.P$1 139.44,22.2 136.29,19.05 | 136.29,19.05 131.97,19.05 | 131.97,19.05 113.43,19.05 | 136.29,19.05 159.15,19.05 159.15,24.94 DIG2.P$1 | 18.18,96.67 18.18,132.48 19.2,133.5 | 18.18,96.67 18.18,61.85 | AN16.P$3 36.34,143.02 29.61,136.29 | 29.61,136.29 21.99,136.29 19.2,133.5 | 29.61,136.29 51.2,136.29 | 51.2,136.29 75.33,136.29 | 75.33,136.29 98.19,136.29 | 98.19,136.29 122.32,136.29 | 122.32,136.29 143.91,136.29 | 143.91,136.29 166.77,136.29 | AN11.P$3 151.91,144.29 143.91,136.29 | AN12.P$3 130.32,144.29 122.32,136.29 | AN13.P$3 106.19,144.29 98.19,136.29 | AN14.P$3 83.33,144.29 75.33,136.29 | AN15.P$3 59.2,144.29 51.2,136.29 | 18.18,96.67 20.21,98.7 37.48,98.7 43.23,104.44 X17.P$3 X18.P$3 | CON1.14 21.59,22.28 21.59,25.8 | 128.67,173.23 151.53,173.23 159.57,165.19 AN2.P$3 | 128.67,173.23 105.56,173.23 | 105.56,173.23 84.22,173.23 | 84.22,173.23 60.6,173.23 | 60.6,173.23 37.48,173.23 | 37.48,173.23 27.83,173.23 | 27.83,173.23 23.51,173.23 21.74,171.45 21.74,162.05 19.2,159.51 19.2,133.5
  Top 0.813: AN7.P$3 44,166.71 37.48,173.23 | AN6.P$3 66.86,166.97 60.6,173.23 | AN5.P$3 89.72,167.73 84.22,173.23 | AN4.P$3 112.58,166.21 105.56,173.23 | AN3.P$3 135.44,166.46 128.67,173.23 | AN8.P$3 24.19,169.58 27.83,173.23 | AN1.P$3 159.91,129.43 166.77,136.29 | 166.77,136.29 167.4,135.66 AN9.P$3 | 166.77,136.29 169.69,139.21 AN10.P$3 | DIG9.P$1 148.69,83.06 v147.47,83.06 | v144.42,76.2 144.42,75.33 143.15,74.06 | v134,16 134,17.02 131.97,19.05 | DIG12.P$1 114.06,69.49 109.49,74.06
  Bottom 0.813: v147.47,83.06 147.47,79.25 v144.42,76.2 | v134,16 142.24,7.77 DIG1.P$1
-15V  (via drill 0.61)
  Top 0.813: X18.P$2 X17.P$2 38.23,104.27 v34.69,100.73 | v35.71,89.41 35.71,90.68 v42.31,97.28
  Bottom 0.813: CON1.16 18.96,12.46 26.31,19.81 26.31,42.42 38.25,54.36 38.25,75.44 43.58,80.77 43.58,81.53 v35.71,89.41 | v42.31,97.28 40.28,97.28 37.48,100.08 35.34,100.08 v34.69,100.73
A1  (via drill 0.71)
  Top 0.254: RB1.2 151.32,120.7 | RA1.1 148.04,120.65
  Top 0.305: U1.25 102.69,104.95 104.54,106.81
  Top 0.508: 151.32,120.7 RA1.1 | 148.04,120.65 137.56,120.65 | 137.56,120.65 v120.54,120.65 | 104.54,106.81 106.06,106.81 111.53,112.27 v113.68,112.27 | TPB1.TP 137.56,120.65
  Bottom 0.508: v120.54,120.65 113.68,113.79 v113.68,112.27
A2  (via drill 0.61, 0.71)
  Top 0.254: RB2.2 153.86,154.99
  Top 0.305: U1.26 102.19,105.74 102.2,105.74 103.14,106.68
  Top 0.508: 144.93,114.7 111.14,114.7 103.14,106.7 103.14,106.68 | 144.93,114.7 149.75,114.7 v151.02,115.97 | 153.86,154.99 RA2.1 | v155.59,138.68 155.59,153.25 RB2.2 | TPB2.TP 144.93,117.35 144.93,114.7
  Bottom 0.254: v155.59,138.68 155.65,138.63
  Bottom 0.508: v151.02,115.97 151.02,125.22 153.56,127.76 153.56,136.65 v155.59,138.68
A3  (via drill 0.61, 0.71)
  Top 0.305: U1.27 101.69,107.78 101.7,107.78 102.25,108.33
  Top 0.508: RA3.1 129.47,154.99 RB3.2 131.86,154.38 133.75,152.49 v133.75,141.73 | v109.11,115.21 102.25,108.35 102.25,108.33
  Bottom 0.508: v109.11,115.21 133.75,139.85 v133.75,141.73
A4  (via drill 0.61, 0.71)
  Top 0.254: RB4.2 106.87,154.99
  Top 0.305: U1.28 101.19,112.87 101.2,112.87 101.62,113.28
  Top 0.508: 106.87,154.99 RA4.1 | RB4.2 107.22,151.5 v109.62,149.1 | 101.62,113.28 101.62,113.3 v105.3,116.99
  Bottom 0.508: v105.3,116.99 122.83,134.51 122.83,138.68 112.41,149.1 v109.62,149.1
A5  (via drill 0.61, 0.71)
  Top 0.254: RA5.1 81.89,154.89
  Top 0.305: U1.29 100.69,117.2 v100.73,117.24
  Top 0.508: 81.89,154.89 RB5.2 85.88,154.89 88.28,152.49 v88.28,150.37
  Bottom 0.254: v100.73,117.24 100.48,117.49
  Bottom 0.508: 100.48,117.49 100.48,139.45 99.31,140.61 98.04,140.61 v88.28,150.37
A6  (via drill 0.61, 0.71)
  Top 0.305: U1.30 100.19,111.94 99.35,112.78 99.33,112.78
  Top 0.508: RA6.1 60.89,156.77 RB6.2 61.5,150.74 v68.73,143.51 | v95.4,116.73 95.4,116.71 99.33,112.78
  Bottom 0.508: v95.4,116.73 95.4,137.81 89.7,143.51 v68.73,143.51
A7  (via drill 0.61)
  Top 0.254: RB7.2 38.29,156.77
  Top 0.305: U1.31 99.69,107.87 99.67,107.87 99.08,108.46
  Top 0.508: v91.08,118.76 96.16,113.68 96.16,111.4 99.08,108.48 99.08,108.46 | 38.29,156.77 RA7.1 | RB7.2 38.64,155.05 43.07,150.62 43.07,146.3 v49.68,139.7
  Bottom 0.508: v91.08,118.76 91.08,120.8 69.89,141.99 65.42,141.99 63.14,139.7 v49.68,139.7
A8  (via drill 0.61)
  Top 0.254: 99.21,104.17 U1.32 | RB8.2 15.43,156.77 | v15.89,145.54 15.78,145.66
  Top 0.305: 99.21,104.17 99.21,107.08 99.19,107.08 98.7,107.57
  Top 0.508: v71.52,131.21 75.08,131.21 98.7,107.59 98.7,107.57 | 15.43,156.77 RA8.1 | v66.69,134.62 66.44,134.87 v26.56,134.87 | 15.78,145.66 RB8.2
  Bottom 0.508: v71.52,131.21 68.11,134.62 v66.69,134.62 | v26.56,134.87 v15.89,145.54
A9  (via drill 0.61, 0.71)
  Top 0.254: 160.25,123.74 RA9.1
  Top 0.305: U1.33 98.69,106.33 96.41,108.6 95.52,108.6
  Top 0.508: v122.07,117.35 119.38,120.03 v88.03,120.03 | v148.23,125.98 158.01,125.98 158.14,125.86 | 158.14,125.86 RA9.1 | RB9.2 160.25,123.74 | v86.89,117.09 87.03,117.09 95.52,108.6 | TPB9.TP 162.2,125.86 158.14,125.86
  Bottom 0.508: v88.03,120.03 86.76,118.76 86.76,117.22 v86.89,117.09 | v148.23,125.98 139.59,117.35 v122.07,117.35
A10  (via drill 0.61)
  Top 0.254: RB10.2 167.77,160.48 | v85.74,122.83 85.85,122.94
  Top 0.305: U1.34 98.19,105.81 96.67,107.33 94.63,107.33
  Top 0.508: v157.88,138.32 157.88,153.19 RA10.1 167.77,160.48 | 85.85,122.94 134.26,122.94 144.31,132.99 v157.12,132.99 | v83.2,120.29 83.2,118.76 94.63,107.33
  Bottom 0.508: v83.2,120.29 v85.74,122.83 | v157.12,132.99 157.88,133.75 v157.88,138.32
A11  (via drill 0.61)
  Top 0.254: 142.4,158.79 RA11.1 142.26,158.75
  Top 0.305: U1.35 97.69,105.3 96.92,106.06 94.63,106.06
  Top 0.508: v83.46,124.35 125.37,124.35 v134.77,133.75 | v135.53,138.32 135.53,155.45 138.83,158.75 142.26,158.75 | 94.63,106.06 81.43,119.27 v81.43,121.3 | 142.4,158.79 RB11.2
  Bottom 0.508: v83.46,124.35 81.43,122.32 v81.43,121.3 | v134.77,133.75 134.77,137.56 v135.53,138.32
A12  (via drill 0.61)
  Top 0.254: RB12.2 123.32,158.71 | 120.42,159 RA12.1
  Top 0.305: U1.36 95.53,104.15
  Top 0.508: v111.91,138.83 111.91,153.16 117.75,159 120.42,159 | 95.53,104.15 80.16,119.53 v80.16,124.1 | v81.68,126.13 104.29,126.13 v111.65,133.5 | 123.32,158.71 RA12.1
  Bottom 0.254: 111.65,138.58 v111.91,138.83 | v80.16,124.1 80.16,124.61
  Bottom 0.508: v111.65,133.5 111.65,138.58 | 80.16,124.61 v81.68,126.13
A13  (via drill 0.61)
  Top 0.254: U1.37 95.41,102.75 | 77.11,124.61 v77.36,124.86 | RB13.2 99.45,158.71 | 96.38,158.5 RA13.1
  Top 0.305: 95.41,102.75 94.89,103.25
  Top 0.508: 94.89,103.25 77.11,121.05 77.11,124.61 | v80.41,127.91 82.95,127.91 v89.05,134 | v91.08,137.81 91.08,155.45 94.13,158.5 96.38,158.5 | 99.45,158.71 RA13.1
  Bottom 0.508: v77.36,124.86 v80.41,127.91 | v89.05,134 89.05,135.78 v91.08,137.81
A14  (via drill 0.61)
  Top 0.254: RB14.2 76.33,158.71
  Top 0.305: U1.38 94.64,102.25 94.25,102.62
  Top 0.508: 94.25,102.62 67.2,129.69 67.2,131.97 v70,134.77 | v70,138.07 70,156.75 71.95,158.71 RA14.1 76.33,158.71
  Bottom 0.508: v70,134.77 v70,138.07
A15  (via drill 0.61)
  Top 0.254: RA15.1 49.69,160.57 49.69,160.13
  Top 0.305: U1.39 93.85,101.75 93.36,102.23
  Top 0.508: v65.17,130.45 93.36,102.23 | RA15.1 48.61,160.48 46.63,158.5 46.63,146.56 v51.45,141.73 | v59.33,141.73 62.01,141.73 v64.92,138.83 | 49.69,160.13 RB15.2
  Bottom 0.254: v64.92,138.83 64.92,130.7 v65.17,130.45
  Bottom 0.508: v51.45,141.73 v59.33,141.73
A16  (via drill 0.61)
  Top 0.254: RB16.2 29.6,156.93
  Top 0.305: 91.84,101.98 92.57,101.25 U1.40
  Top 0.508: v44.85,131.21 62.63,131.21 91.84,101.98 | RA16.1 29.6,156.93 31.69,156.93 39.26,149.35 39.26,143.15 v42.31,140.1
  Bottom 0.508: v42.31,140.1 42.31,133.75 v44.85,131.21
AOUT  (via drill 0.61)
  Top 0.254: 95.77,100.73 U1.41
  Top 0.305: 91.81,100.74 95.77,100.74 U1.41
  Top 0.508: v14.62,93.36 11.32,90.06 v11.32,36.07 | v67.2,100.73 82.31,100.73 | 82.31,100.73 91.81,100.74 | TPB.TP 82.31,103.5 82.31,100.73
  Bottom 0.508: v14.62,93.36 59.84,93.36 v67.2,100.73 | v11.32,36.07 8.78,36.07 5.99,33.27 5.99,29.97 7.26,28.7 7.26,26.67 9.16,24.77 9.16,22.86 10.69,21.34 13.03,21.34 CON1.8
D1  (via drill 0.61, 0.71)
  Top 0.254: 151.55,13.58 DIG1.P$2 | U1.12 102.97,95.85 102.97,95.86 | 151.55,13.58 148.54,16.59 R1.1 150.84,16.59 v151.53,17.27 | 151.55,13.58 151.57,13.58 C1.1
  Top 0.508: 102.97,95.86 111.2,95.85 v114.19,92.86 | v153.82,39.37 153.82,41.66 v153.56,41.91 | v148.48,76.2 146.45,76.2 v143.66,78.99 | TPA1.TP 130.19,92.46 v126.38,92.46
  Bottom 0.508: v114.19,92.86 116.73,92.86 117.13,92.46 123.97,92.46 124.1,92.46 | v151.53,17.27 151.53,22.35 154.83,25.65 154.83,38.35 v153.82,39.37 | v153.56,41.91 153.56,71.12 v148.48,76.2 | v143.66,78.99 137.56,78.99 124.1,92.46 | v126.38,92.46 124.1,92.46
D2  (via drill 0.61, 0.71)
  Top 0.305: 102.51,94.38 102.19,94.7 U1.11
  Top 0.508: 167.3,30.34 R2.1 163.02,37.27 v160.17,40.13 | 102.51,94.38 111.4,94.38 112.41,93.36 112.41,91.33 110.63,89.54 | 110.63,89.54 v108.1,87.01 | 167.3,30.34 167.3,28.09 DIG2.P$2 | 167.3,30.34 167.3,32.61 C2.1 | TPA2.TP 109.11,91.06 110.63,89.54
  Bottom 0.254: v160.17,40.13 159.91,40.39
  Bottom 0.508: v108.1,87.01 111.4,83.71 111.4,82.95 115.97,78.38 115.97,77.62 132.35,61.23 132.35,56.41 148.37,40.39 159.91,40.39
D3  (via drill 0.61)
  Top 0.305: U1.10 101.69,94.19 103.02,92.86
  Top 0.508: 144.44,30.34 R3.1 140.16,38.92 v140.61,39.37 | 144.44,30.34 DIG3.P$2 | C3.1 148.73,34.63 144.44,30.34 | 103.02,92.86 109.62,92.86 v110.38,92.09 | v131.21,67.71 131.21,53.49 v131.46,53.23
  Bottom 0.508: v110.38,92.09 112.92,92.09 114.19,90.82 119.78,90.82 120.54,90.06 120.54,78.38 v131.21,67.71 | v131.46,53.23 131.46,50 140.61,40.86 v140.61,39.37
D4  (via drill 0.61)
  Top 0.254: v115.72,40.13 117.24,38.61 117.24,34.68 R4.1
  Top 0.305: v106.06,88.03 101.19,92.91 U1.9
  Top 0.508: R4.1 121.58,30.34 | 121.58,30.34 DIG4.P$2 | C4.1 125.87,34.63 121.58,30.34 | v114.7,76.09 115.72,77.11 v118.76,77.11
  Bottom 0.508: v115.72,40.13 121.56,45.97 121.56,66.95 114.7,73.81 v114.7,76.09 | v118.76,77.11 118.76,83.46 114.19,88.03 v106.06,88.03
D5  (via drill 0.61)
  Top 0.254: 100.69,89.6 v102.76,87.52 | v104.54,39.12 C5.1
  Top 0.305: U1.8 100.69,89.6
  Top 0.508: R5.1 98.72,30.34 | 98.72,30.34 DIG5.P$2 | C5.1 103.01,34.63 98.72,30.34 | v103.27,84.98 103.27,82.55 v102,81.28
  Bottom 0.254: 103.02,40.64 v104.54,39.12
  Bottom 0.508: v102.76,87.52 102.76,85.49 v103.27,84.98 | 103.02,40.64 103.02,80.66 102.4,81.28 v102,81.28
D6  (via drill 0.61)
  Top 0.254: C6.1 v81.69,40.4
  Top 0.305: 100.19,88.57 U1.7
  Top 0.508: R6.1 75.86,30.34 | 75.86,30.34 DIG6.P$2 | C6.1 80.15,34.63 75.86,30.34 | v100.73,77.11 105.3,77.11 v107.08,75.33 | v101.49,85.24 101.49,82.7 100.33,81.53 v99.46,81.53 | v100.73,88.03 100.19,88.57 | v83.97,44.45 86,46.48 v106.06,46.48
  Bottom 0.254: 107.08,47.5 v106.06,46.48
  Bottom 0.508: v81.69,40.4 81.69,42.17 v83.97,44.45 | v100.73,77.11 99.46,78.38 v99.46,81.53 | v101.49,85.24 100.73,86 v100.73,88.03 | v107.08,75.33 107.08,47.5
D7  (via drill 0.61)
  Top 0.254: U1.6 99.71,95.82 | 57.8,34.87 C7.1
  Top 0.305: 99.71,95.82 99.71,89.05 v97.94,87.27
  Top 0.508: R7.1 51.73,30.34 | 51.73,30.34 DIG7.P$2 | C7.1 56.02,34.63 51.73,30.34 | v97.68,84.73 97.68,81.43 v93.62,81.43 | v91.84,76.85 88.28,76.85 v86.76,75.33 | v57.8,39.88 57.8,34.87
  Bottom 0.508: v97.94,87.27 97.94,84.98 v97.68,84.73 | v93.62,81.43 91.84,79.65 v91.84,76.85 | v86.76,75.33 86.76,49.17 85.38,47.79 82.95,47.79 80.5,45.34 63.27,45.34 v57.8,39.88
D8  (via drill 0.61)
  Top 0.305: U1.5 99.19,91.31 98.57,90.7 98.57,90.68
  Top 0.508: R8.1 28.87,30.34 | 28.87,30.34 DIG8.P$2 | 28.87,30.34 33.16,34.63 C8.1 34.7,39.38 v35.45,40.13 | v84.47,76.09 86.76,78.38 v90.06,78.38 | v95.65,87.78 95.67,87.78 98.57,90.68
  Bottom 0.508: v35.45,40.13 35.45,45.21 v36.72,46.48 78.23,46.48 v79.14,47.39 84.47,52.72 v84.47,76.09 | v90.06,78.38 90.06,82.19 v95.65,87.78
D9  (via drill 0.61)
  Top 0.254: 157.37,86.74 DIG9.P$2
  Top 0.305: U1.4 98.69,92.84 97.17,91.33
  Top 0.508: R9.1 157.35,79.43 | 157.35,79.43 DIG9.P$2 154.77,89.3 141.62,89.3 | C9.1 160.27,76.52 157.35,79.43 | 97.17,91.33 94.63,91.33 v93.62,90.32 | v118.26,89.3 141.62,89.3 | TPA9.TP 141.5,89.43 141.62,89.3
  Bottom 0.508: v93.62,90.32 93.62,89.55 93.87,89.3 v118.26,89.3
D10  (via drill 0.61, 0.71)
  Top 0.305: U1.3 98.19,93.61 97.17,92.6
  Top 0.508: R10.1 164.79,59.36 | 164.79,59.36 DIG10.P$2 | C10.1 167.71,56.45 164.79,59.36 | 97.17,92.6 93.62,92.6 91.84,90.82 91.84,89.81 95.4,86.25 v105.3,86.25 | v111.4,80.92 v153.31,80.92
  Bottom 0.254: 164.74,66.46 DIG10.P$2
  Bottom 0.508: v105.3,86.25 106.06,86.25 v111.4,80.92 | 164.74,66.46 164.74,69.49 159.3,74.93 156.61,74.93 156.1,75.44 156.1,79.5 154.69,80.92 v153.31,80.92
D11  (via drill 0.61)
  Top 0.254: 141.89,58.57 141.89,58.82
  Top 0.305: U1.2 97.69,94.38 96.92,93.62
  Top 0.508: R11.1 141.89,58.57 | DIG11.P$2 141.89,58.82 145.27,55.44 C11.1 | v130.45,79.65 110.38,79.65 v109.11,80.92 | 96.92,93.62 93.11,93.62 90.32,90.82 90.32,89.3 v95.9,83.71
  Bottom 0.508: DIG11.P$2 141.89,68.21 v130.45,79.65 | v95.9,83.71 106.32,83.71 v109.11,80.92
D12  (via drill 0.61)
  Top 0.305: U1.1 92.04,95.85
  Top 0.508: R12.1 119.06,58.72 | 119.06,58.72 DIG12.P$2 | C12.1 122.08,55.7 119.06,58.72 | 92.04,95.85 87.52,91.33 87.52,89.41 v93.49,83.44
  Bottom 0.254: DIG12.P$2
  Bottom 0.508: DIG12.P$2 102.53,82.93 97.05,82.93 96.79,82.68 94.25,82.68 v93.49,83.44
D13  (via drill 0.61)
  Top 0.254: 95.71,97.17 U1.48
  Top 0.305: 90.06,96.67 90.57,97.17 95.71,97.17
  Top 0.508: R13.1 96.26,59.09 | 96.26,59.09 DIG13.P$2 | C13.1 99.39,55.96 96.26,59.09 | v82.7,81.68 82.7,89.3 90.06,96.67
  Bottom 0.508: DIG13.P$2 96.26,68.12 v82.7,81.68
D14  (via drill 0.61)
  Top 0.305: 88.03,97.16 88.61,97.75 U1.47
  Top 0.508: R14.1 73.31,59.16 | 73.31,59.16 DIG14.P$2 | C14.1 76.26,56.21 73.31,59.16 | v74.57,83.71 88.03,97.16
  Bottom 0.508: DIG14.P$2 73.31,82.45 v74.57,83.71
D15  (via drill 0.61)
  Top 0.254: 50.44,66.5 DIG15.P$2
  Top 0.305: 82.04,97.51 82.7,98.19 82.76,98.25 U1.46
  Top 0.508: R15.1 50.5,59.58 | 50.5,59.58 DIG15.P$2 | C15.1 53.61,56.47 50.5,59.58 | v68.47,83.97 82.04,97.51
  Bottom 0.508: DIG15.P$2 50.5,70.57 63.9,83.97 v68.47,83.97
D16  (via drill 0.61)
  Top 0.254: 32.01,56.61 C16.1 | 27.69,57.55 27.69,57.26
  Top 0.305: 79.42,98.22 79.95,98.75 U1.45
  Top 0.508: 32.01,56.61 28.34,56.61 27.69,57.26 | DIG16.P$2 27.69,58.07 27.69,57.55 26.75,56.61 R16.1 | v32.15,78.63 41.55,88.03 69.23,88.03 79.42,98.22
  Bottom 0.508: v32.15,78.63 28.34,74.82 28.34,67.01 DIG16.P$2
DOUT  (via drill 0.61)
  Top 0.305: 93.95,99.75 U1.43
  Top 0.508: v50.95,95.65 55.05,99.75 63.27,99.75 | 63.27,99.75 93.95,99.75 | v10.31,95.4 3.96,89.05 3.96,25.15 10.31,18.8 13.03,18.8 CON1.10 | TPA.TP 63.27,107.31 63.27,99.75
  Bottom 0.254: v10.31,95.4 10.56,95.65
  Bottom 0.508: 10.56,95.65 v50.95,95.65
GND
  Top 0.254: U1.24 U1.23
  Top 0.305: 105.55,102.75 105.56,102.74
  pour Top (isolate 0.635): -30,205 -30,-5 230,-5 230,205
  pour Bottom (isolate 0.635): -55,205 -55,-5 230,-5 230,205
MOSI  (via drill 0.61, 0.71)
  Top 0.254: v19.7,22.35 19.66,22.35 | 172.36,82.3 v172.1,82.04
  Top 0.305: U1.18 106.35,99.75 107.13,100.53
  Top 0.508: 107.13,100.53 115.46,108.86 163.83,108.86 172.36,100.33 172.36,82.3 | v20.21,18.8 17.93,16.51 17.93,13.21 27.32,3.81 162.2,3.81 164.23,5.84 164.23,7.37 v167.53,10.67 | 19.66,22.35 CON1.4
  Bottom 0.508: v20.21,18.8 20.21,21.84 v19.7,22.35 | v172.1,82.04 170.58,82.04 167.53,78.99 v167.53,10.67
N$1
  Top 0.508: RA2.2 151.64,161.73 149.57,163.81 AN2.P$1
N$2
  Top 0.508: RA1.2 146.01,125.06 AN1.P$1
N$3
  Top 0.508: RA3.2 127.51,162.15 AN3.P$1
N$4
  Top 0.508: RA4.2 104.65,162.15 AN4.P$1
N$5
  Top 0.508: AN5.P$1 79.51,164.02 79.51,161.34 81.79,159.05 RA5.2
N$6
  Top 0.508: RA6.2 58.93,162.15 AN6.P$1
N$7
  Top 0.508: AN7.P$1 36.07,162.15 RA7.2
N$8
  Top 0.508: RA8.2 13.21,163.51 AN8.P$1
N$9
  Top 0.508: RA9.2 160.09,112.59 159.69,112.19 AN9.P$1
N$10
  Top 0.508: AN10.P$1 165.17,152.72 RA10.2
N$11
  Top 0.508: RA11.2 142.31,147.39 AN11.P$1
N$12
  Top 0.508: RA12.2 120.72,147.39 AN12.P$1
N$13
  Top 0.508: RA13.2 96.59,147.39 AN13.P$1
N$14
  Top 0.508: RA14.2 73.73,147.39 AN14.P$1
N$15
  Top 0.254: 49.6,147.39 AN15.P$1
  Top 0.508: RA15.2 49.6,147.39
N$16
  Top 0.254: 26.74,147.39 AN16.P$1
  Top 0.508: RA16.2 26.74,147.39
SCK  (via drill 0.61, 0.71)
  Top 0.254: CON1.6 13.85,25.16
  Top 0.305: U1.19 105.58,100.25 106.34,100.97
  Top 0.508: 106.34,100.97 116.33,111 v133.24,111 | 13.85,25.16 12.59,26.42 8.53,26.42 v6.5,24.38 | v25.55,3.05 26.82,1.78 162.71,1.78 163.21,2.29 v164.23,2.29
  Bottom 0.508: v6.5,24.38 4.46,22.35 4.46,12.7 10.56,6.6 21.99,6.6 v25.55,3.05 | v133.24,111 148.23,111 164.99,94.23 164.99,71.63 166.52,70.1 166.52,31.5 162.45,27.43 162.45,4.06 v164.23,2.29
SS  (via drill 0.61, 0.71)
  Top 0.254: 104.13,99.21 U1.17
  Top 0.305: 107.84,99.21 104.13,99.21
  Top 0.508: 107.84,99.21 114.45,105.81 159.15,105.81 170.83,94.13 v170.83,78.23 | v19.96,24.13 19.96,24.59 CON1.2 | v22.75,20.57 30.63,12.7 v141.62,12.7 | v172.36,14.99 170.07,12.7 v159.66,12.7
  Bottom 0.508: v22.75,20.57 22.75,21.34 v19.96,24.13 | v172.36,14.99 172.36,48.26 171.85,48.77 171.85,77.22 v170.83,78.23 | v141.62,12.7 v159.66,12.7

### Text on the board
tNames: Srylab 05/2022 / A/D Inputs / Jacopo De Santis / v1.0